# Altium schematic sheet MSD.SchDoc
size A; SheetNumber: 1; SheetTotal: 1
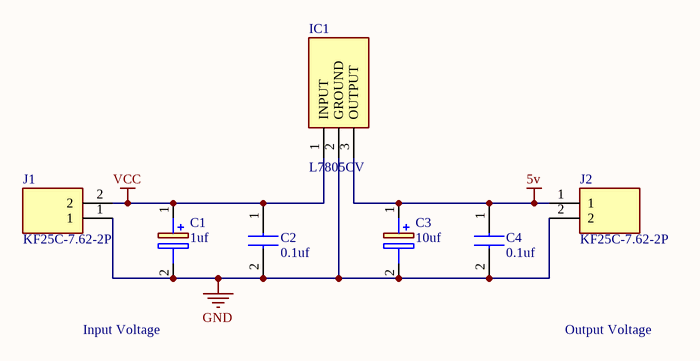
[diagram p0: MSD.SchDoc]

## Parts
C1  1uf  [CAPPRD350W65D825H1250]
C2  0.1uf  [CAPPRD200W50D550H1250]
C3  10uf  [CAPPRD500W65D1000H2200]
C4  0.1uf  [CAPPRD200W50D550H1250]
IC1  L7805CV  [TO255P460X1020X2008-3P]
J1  KF25C-7.62-2P  [KF25C7622P]
J2  KF25C-7.62-2P  [KF25C7622P]

## Nets
5v: C3.1(+) C4.1(+) IC1.3(OUTPUT) J2.1
GND: C1.2(-) C2.2(-) C3.2(-) C4.2(-) IC1.2(GROUND) J1.1 J2.2
VCC: C1.1(+) C2.1(+) IC1.1(INPUT) J1.2

## Notes on the sheet
- Input Voltage
- Output Voltage

## Library data of the parts
C1 = ECA-2WM010: Capacitor Polarised; Manufacturer_Name: Panasonic; Datasheet Link: http://www.mouser.com/ds/2/315/ABA0000C1047-947484.pdf; Height: 12.5mm; Manufacturer_Part_Number: ECA-2WM010; Mouser Part Number: 667-ECA-2WM010; Mouser Price/Stock: https://www.mouser.com/Search/Refine.aspx?Keyword=667-ECA-2WM010
C2 C4 = UPS1H010MDD: Capacitor; Manufacturer_Name: Nichicon; Datasheet Link: http://nichicon-us.com/english/products/pdfs/e-ups.pdf; Height: 12.5mm; Manufacturer_Part_Number: UPS1H010MDD; Mouser Part Number: 647-UPS1H010MDD; Mouser Price/Stock: https://www.mouser.co.uk/ProductDetail/Nichicon/UPS1H010MDD?qs=9WxBXDvRDok3DT3K8wfJRA%3D%3D
C3 = EEU-EB2V100: Capacitor Polarised; Manufacturer_Name: Panasonic; Datasheet Link: http://industrial.panasonic.com/cdbs/www-data/pdf/RDF0000/ABA0000C1024.pdf; Height: 22mm; Manufacturer_Part_Number: EEU-EB2V100; Mouser Part Number: 667-EEU-EB2V100; Mouser Price/Stock: https://www.mouser.co.uk/ProductDetail/Panasonic/EEU-EB2V100?qs=NWUXdpDx7QA5MeFM%2FszRZQ%3D%3D; Arrow Part Number: EEU-EB2V100; Arrow Price/Stock: https://www.arrow.com/en/products/eeu-eb2v100/panasonic?region=nac
IC1 = L7805CV: Integrated Circuit; Manufacturer_Name: STMicroelectronics; Datasheet Link: http://www.st.com/web/en/resource/technical/document/datasheet/CD00000444.pdf; Height: 4.6mm; Manufacturer_Part_Number: L7805CV; Mouser Part Number: 511-L7805CV; Mouser Price/Stock: https://www.mouser.co.uk/ProductDetail/STMicroelectronics/L7805CV?qs=9NrABl3fj%2FqplZAHiYUxWg%3D%3D; Arrow Part Number: L7805CV; Arrow Price/Stock: https://www.arrow.com/en/products/l7805cv/stmicroelectronics?region=europe
J1 J2 = KF25C-7.62-2P: Connector; Manufacturer_Name: KEFA; Datasheet Link: https://datasheet.lcsc.com/lcsc/2007211836_Cixi-Kefa-Elec-KF25C-7-62-2P_C707361.pdf; Height: 14.9mm; Manufacturer_Part_Number: KF25C-7.62-2P